# EAGLE board RefOsc10MHz_3V0_bga-escaped (EAGLE 7.2.0)
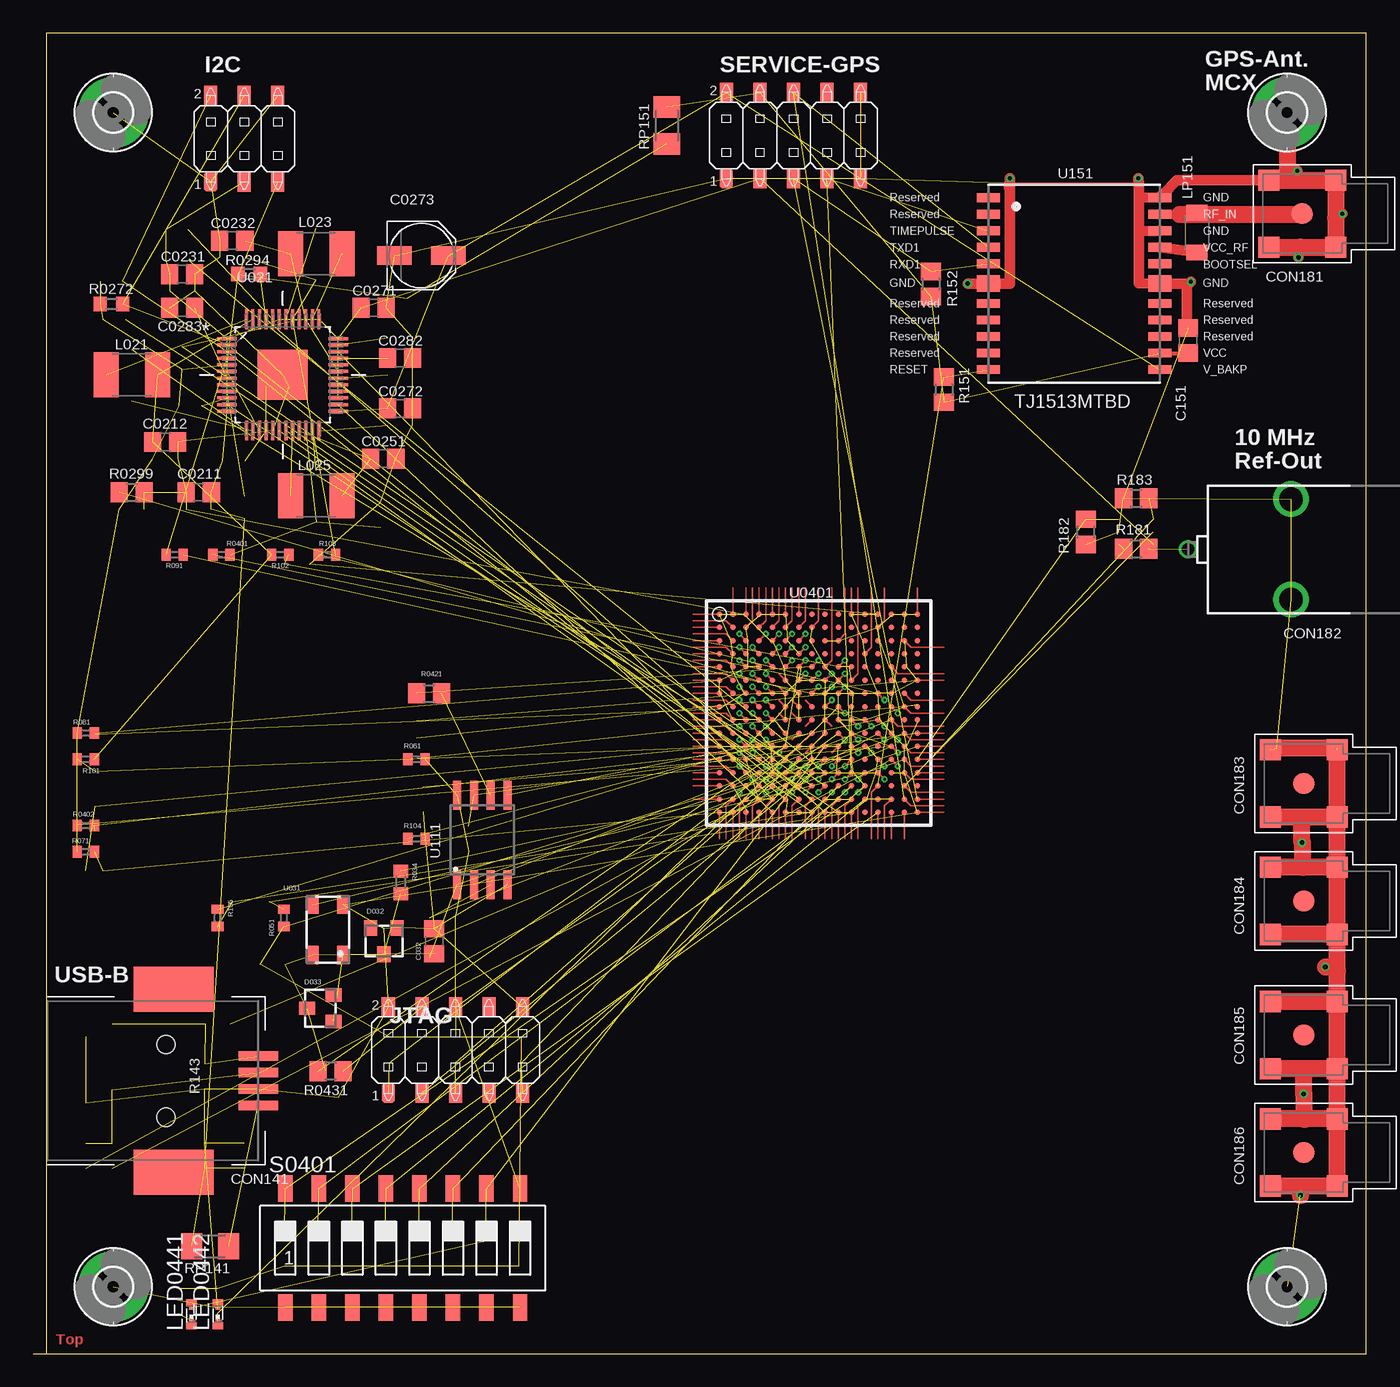
[diagram p27: board, top side]
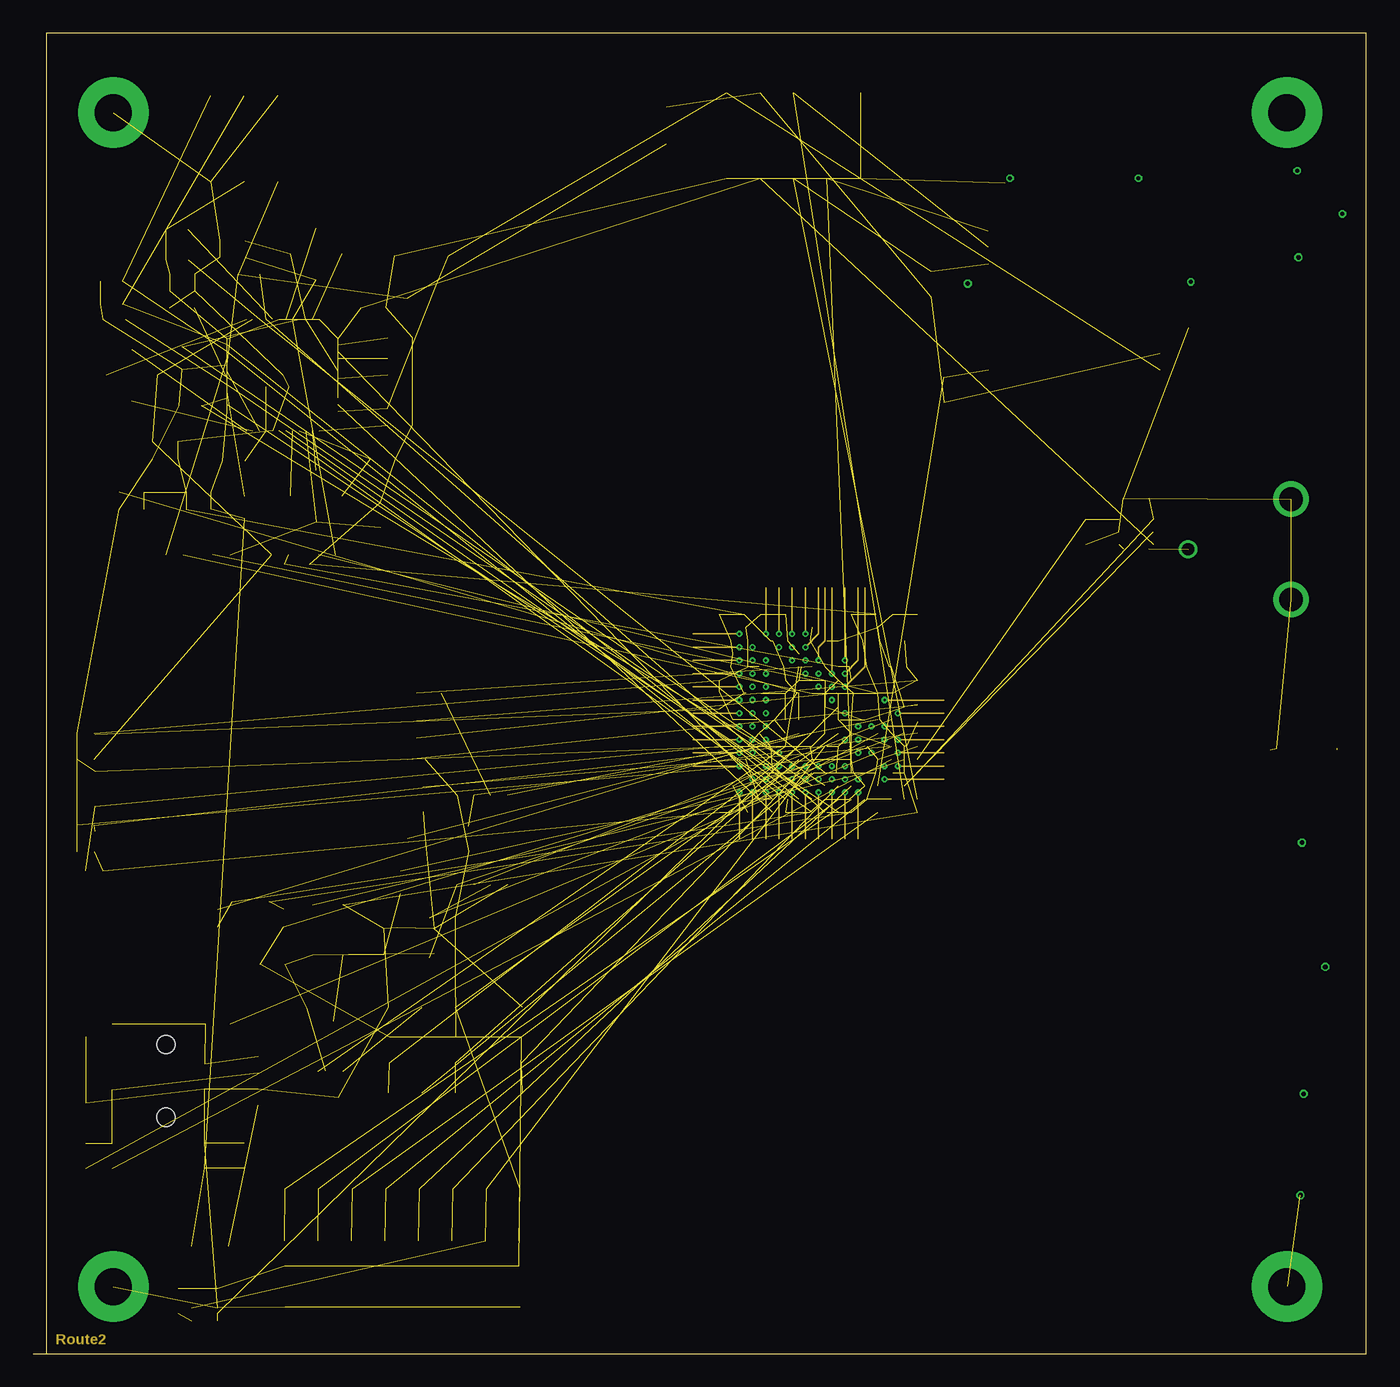
[diagram p28: board, inner layer Route2]
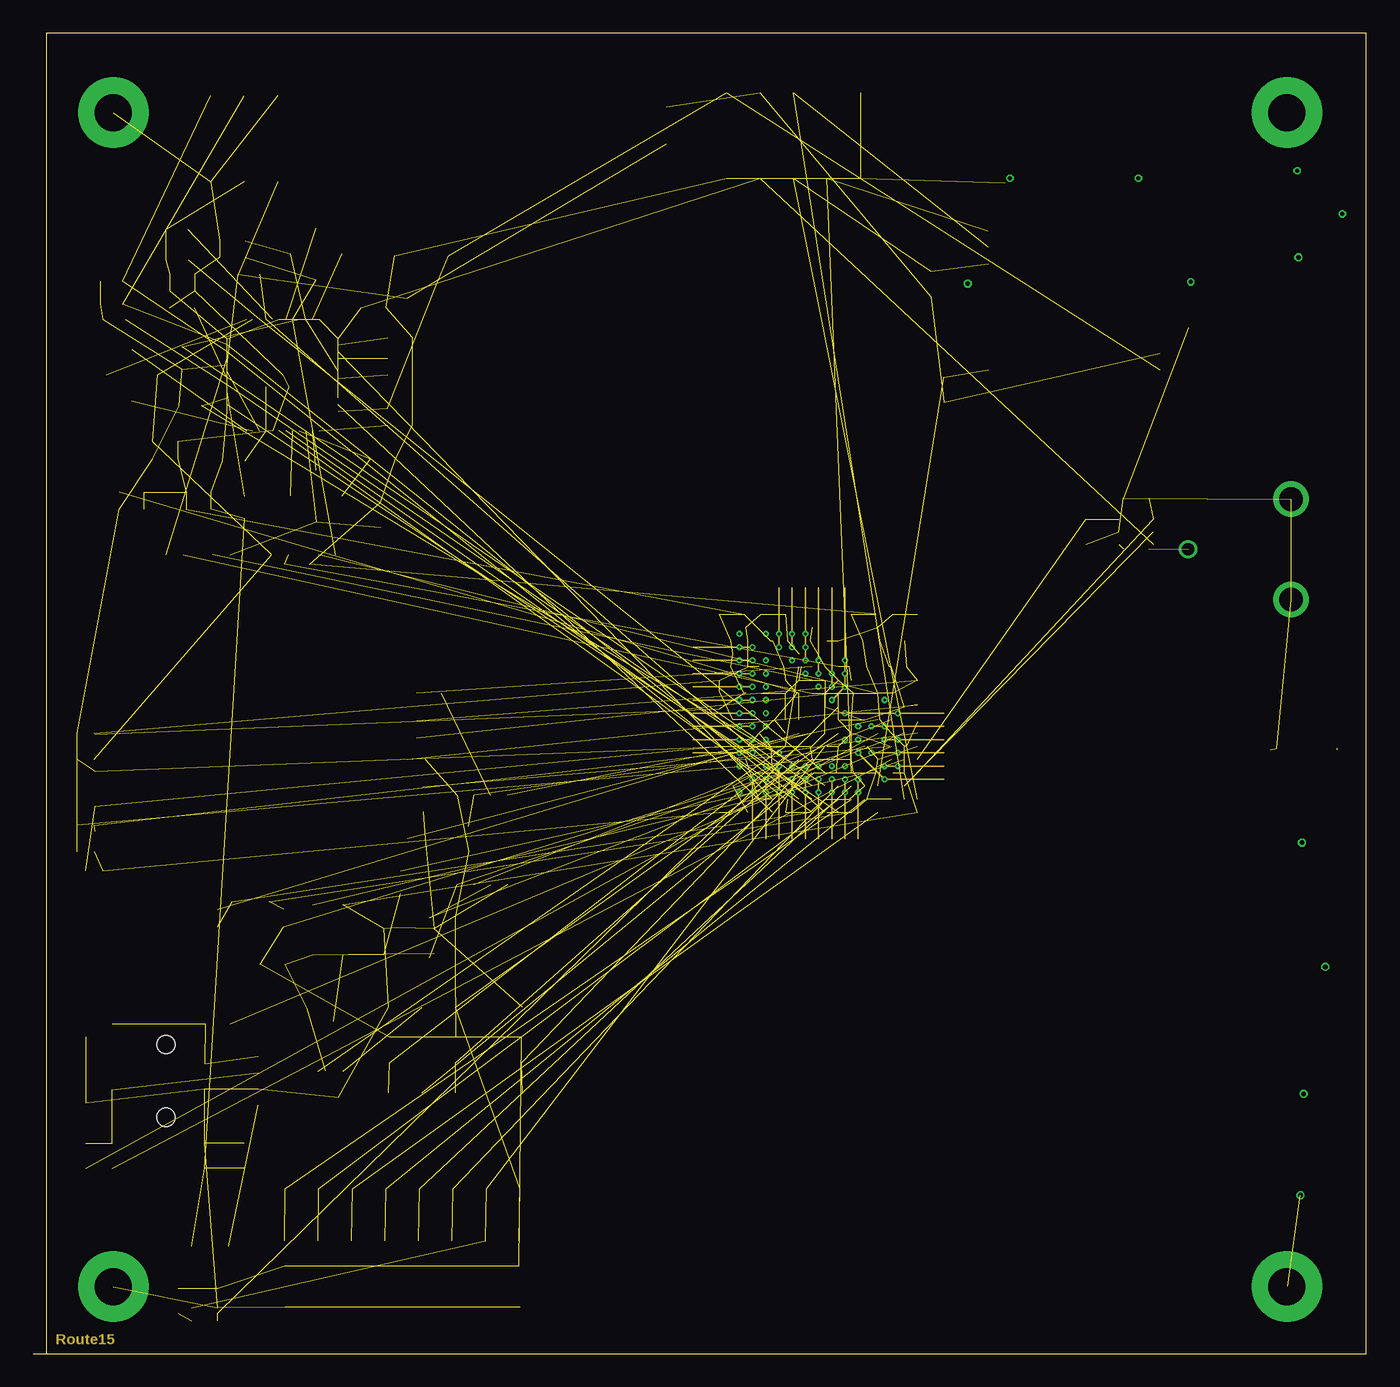
[diagram p29: board, inner layer Route15]
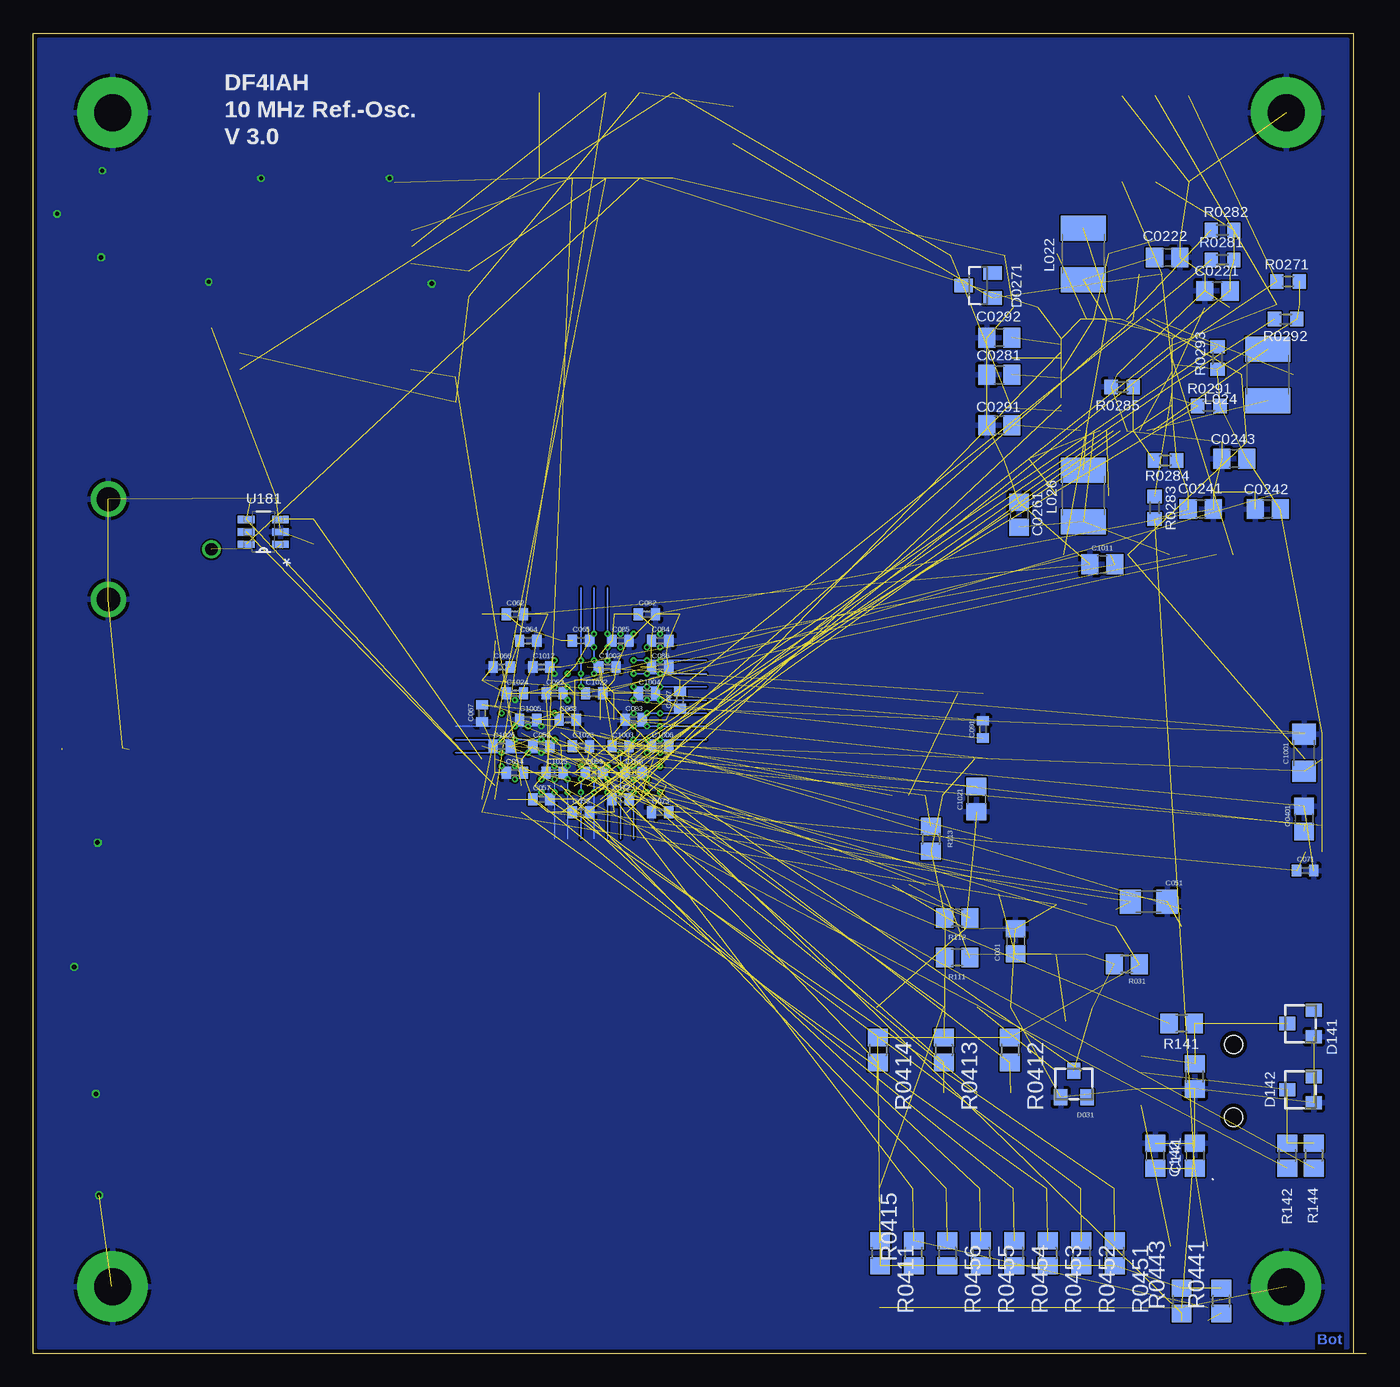
[diagram p30: board, bottom side, seen from below]

Size 101 x 100 mm. Coordinates in mm from the lower left corner, seen from the top.
Outline: 1,0 101,0 101,100 1,100 1,0
Outline: 0,0 1,0
Copper layers (1+2+15+16): Top 0.035mm / dielectric 0.38mm / Route2 0.035mm / dielectric 0.71mm / Route15 0.035mm / dielectric 0.38mm / Bottom 0.035mm
Design rules "PCB-Pool_HighQuality_4Layers": minimum track width 5mil, minimum drill 8mil, track to track 5mil, track to pad 5mil, pad to pad 5mil, via to via 5mil, smd to smd 0mil, copper to edge 12mil, drill to drill 12mil, minimum pad ring 8mil, minimum via ring 5mil, stop-mask expansion 2mil, vias tented up to drill 25mil, thermal gap 10mil
Net classes: 1 PWR_LOW: width 0.254 mm; 2 PWR_MED: width 0.305 mm; 3 PWR_HI: width 0.381 mm; 4 PAIR_50R: width 1.27 mm, clearance 1.27 mm; 5 PAIR_100R: width 0.635 mm, clearance 0.635 mm; 6 CLK: clearance 0.635 mm
tRestrict: area 95,80 to 97.5,80

## Footprints (pad centres in the part's own frame; a part is rotated, then mirrored left to right if it is on the bottom)
C0805 = smd 1.3 x 1.5: 1 -0.95,0; 2 0.95,0
C1206 = smd 1.6 x 1.8: 1 -1.4,0; 2 1.4,0
C0402 = smd 0.7 x 0.9: 1 -0.65,0; 2 0.65,0
PANASONIC_C = smd 2.6 x 1.4: + 2.05,0; - -2.05,0
2X03SMD = smd 1 x 1.5: 1 -2.54,-3.25; 2 -2.54,3.25; 3 0,-3.25; 4 0,3.25; 5 2.54,-3.25; 6 2.54,3.25
TYCO-AMP_USB-B_SMT = smd 6.04 x 3.4: 0A 0,6.92; 0B 0,-6.92 | smd 3 x 0.7: 1 -6.42,1.87; 2 -6.42,-0.62; 3 -6.42,-1.87; 4 -6.42,0.62 | hole 1.4: 0.58,-2.75; 0.58,2.75
2X5SMD = smd 1 x 1.5: 1 -5.08,-3.25; 2 -5.08,3.25; 3 -2.54,-3.25; 4 -2.54,3.25; 5 0,-3.25; 6 0,3.25; 7 2.54,-3.25; 8 2.54,3.25; 9 5.08,-3.25; 10 5.08,3.25
MCX-J-P-X-RA-SM1 = smd 1.6 x 1.6: 1 0,0; 2 -2.54,2.54; 3 2.54,2.54; 4 -2.54,-2.54; 5 2.54,-2.54
MOLEX_BNC-JACK-50R_SD-73100-0105 = drill 0.92: 1 12.4,0 | drill 1.8: 2 4.6,3.8; 3 4.6,-3.8
TO236 = smd 1 x 1.2: A -1,-1; C 0,1; NC 1,-1
SOT23 = smd 1 x 1.4: 1 -0.95,-1.1; 2 0.95,-1.1; 3 0,1.1
2,8-PAD = drill 2.8 pad 5.334: B2,8 0,0
L1812 = smd 1.9 x 3.4: 1 -1.95,0; 2 1.95,0
SMARTLED-TTW = smd 0.8 x 0.5: A 0,-0.875; C 0,0.875 | smd 0.35 x 0.35: A@1 0,-0.5; C@1 0,0.5
L3216C = smd 1.2 x 1.6: 1 -1.5,0; 2 1.5,0
R0805 = smd 1.3 x 1.5: 1 -0.95,0; 2 0.95,0
R0603 = smd 1 x 1.1: 1 -0.85,0; 2 0.85,0
R0402 = smd 0.7 x 0.9: 1 -0.65,0; 2 0.65,0
M1206 = smd 1.6 x 2: 1 -1.4,0; 2 1.4,0
SMS-008 = smd 1.092 x 2.007: 1 -8.89,-4.496; 2 -6.35,-4.496; 3 -3.81,-4.496; 4 -1.27,-4.496; 5 1.27,-4.496; 6 3.81,-4.496; 7 6.35,-4.496; 8 8.89,-4.496; 9 8.89,4.496; 10 6.35,4.496; 11 3.81,4.496; 12 1.27,4.496; 13 -1.27,4.496; 14 -3.81,4.496; 15 -6.35,4.496; 16 -8.89,4.496
QFP50P900X900X120-49N2 = smd 1.5 x 0.225: 1 -4.216,2.743; 2 -4.216,2.261; 3 -4.216,1.753; 4 -4.216,1.245; 5 -4.216,0.762; 6 -4.216,0.254; 7 -4.216,-0.254; 8 -4.216,-0.762; 9 -4.216,-1.245; 10 -4.216,-1.753; 11 -4.216,-2.261; 12 -4.216,-2.743; 25 4.216,-2.743; 26 4.216,-2.261; 27 4.216,-1.753; 28 4.216,-1.245; 29 4.216,-0.762; 30 4.216,-0.254; 31 4.216,0.254; 32 4.216,0.762; 33 4.216,1.245; 34 4.216,1.753; 35 4.216,2.261; 36 4.216,2.743 | smd 0.225 x 1.5: 13 -2.743,-4.216; 14 -2.261,-4.216; 15 -1.753,-4.216; 16 -1.245,-4.216; 17 -0.762,-4.216; 18 -0.254,-4.216; 19 0.254,-4.216; 20 0.762,-4.216; 21 1.245,-4.216; 22 1.753,-4.216; 23 2.261,-4.216; 24 2.743,-4.216; 37 2.743,4.216; 38 2.261,4.216; 39 1.753,4.216; 40 1.245,4.216; 41 0.762,4.216; 42 0.254,4.216; 43 -0.254,4.216; 44 -0.762,4.216; 45 -1.245,4.216; 46 -1.753,4.216; 47 -2.261,4.216; 48 -2.743,4.216 | smd 3.8 x 3.8: 49 0,0
CFPT-141 = smd 1.4 x 0.9: 1 -1.9,-1.15; 2 1.9,-1.15; 3 1.9,1.15; 4 -1.9,1.15
SOP2-8 = smd 2.2 x 0.6: 1 -3.5,1.874; 2 -3.5,0.604; 3 -3.5,-0.666; 4 -3.5,-1.936; 5 3.3,-1.936; 6 3.3,-0.666; 7 3.3,0.604; 8 3.3,1.874
TJ1513MTBD = smd 1.75 x 0.667: 1 -6.35,6.62; 2 -6.35,5.37; 3 -6.35,4.12; 4 -6.35,2.87; 5 -6.35,1.62; 7 -6.35,-1.38; 8 -6.35,-2.63; 9 -6.35,-3.88; 10 -6.35,-5.13; 11 -6.35,-6.38; 12 6.65,-6.38; 13 6.65,-5.13; 14 6.65,-3.88; 15 6.65,-2.63; 16 6.65,-1.38; 18 6.65,1.62; 19 6.65,2.87; 20 6.65,4.12; 21 6.65,5.37; 22 6.65,6.62 | smd 1.75 x 1.25: 6 -6.35,0.12; 17 6.65,0.12
SOT-23-6 = smd 1.27 x 0.559: 1 -1.295,0.94; 2 -1.295,0; 3 -1.295,-0.94; 4 1.295,-0.94; 5 1.295,0; 6 1.295,0.94
FTG256_0MM4 = smd 0.4 x 0.4: A1 -7.5,7.5; A2 -6.5,7.5; A3 -5.5,7.5; A4 -4.5,7.5; A5 -3.5,7.5; A6 -2.5,7.5; A7 -1.5,7.5; A8 -0.5,7.5; A9 0.5,7.5; A10 1.5,7.5; A11 2.5,7.5; A12 3.5,7.5; A13 4.5,7.5; A14 5.5,7.5; A15 6.5,7.5; A16 7.5,7.5; B1 -7.5,6.5; B2 -6.5,6.5; B3 -5.5,6.5; B4 -4.5,6.5; B5 -3.5,6.5; B6 -2.5,6.5; B7 -1.5,6.5; B8 -0.5,6.5; B9 0.5,6.5; B10 1.5,6.5; B11 2.5,6.5; B12 3.5,6.5; B13 4.5,6.5; B14 5.5,6.5; B15 6.5,6.5; B16 7.5,6.5; C1 -7.5,5.5; C2 -6.5,5.5; C3 -5.5,5.5; C4 -4.5,5.5; C5 -3.5,5.5; C6 -2.5,5.5; C7 -1.5,5.5; C8 -0.5,5.5; C9 0.5,5.5; C10 1.5,5.5; C11 2.5,5.5; C12 3.5,5.5; C13 4.5,5.5; C14 5.5,5.5; C15 6.5,5.5; C16 7.5,5.5; D1 -7.5,4.5; D2 -6.5,4.5; D3 -5.5,4.5; D4 -4.5,4.5; D5 -3.5,4.5; D6 -2.5,4.5; D7 -1.5,4.5; D8 -0.5,4.5; D9 0.5,4.5; D10 1.5,4.5; D11 2.5,4.5; D12 3.5,4.5; D13 4.5,4.5; D14 5.5,4.5; D15 6.5,4.5; D16 7.5,4.5; E1 -7.5,3.5; E2 -6.5,3.5; E3 -5.5,3.5; E4 -4.5,3.5; E5 -3.5,3.5; E6 -2.5,3.5; E7 -1.5,3.5; E8 -0.5,3.5; E9 0.5,3.5; E10 1.5,3.5; E11 2.5,3.5; E12 3.5,3.5; E13 4.5,3.5; E14 5.5,3.5; E15 6.5,3.5; E16 7.5,3.5; F1 -7.5,2.5; F2 -6.5,2.5; F3 -5.5,2.5; F4 -4.5,2.5; F5 -3.5,2.5; F6 -2.5,2.5; F7 -1.5,2.5; F8 -0.5,2.5; F9 0.5,2.5; F10 1.5,2.5; F11 2.5,2.5; F12 3.5,2.5; F13 4.5,2.5; F14 5.5,2.5; F15 6.5,2.5; F16 7.5,2.5; G1 -7.5,1.5; G2 -6.5,1.5; G3 -5.5,1.5; G4 -4.5,1.5; G5 -3.5,1.5; G6 -2.5,1.5; G7 -1.5,1.5; G8 -0.5,1.5; G9 0.5,1.5; G10 1.5,1.5; G11 2.5,1.5; G12 3.5,1.5; G13 4.5,1.5; G14 5.5,1.5; G15 6.5,1.5; G16 7.5,1.5; H1 -7.5,0.5; H2 -6.5,0.5; H3 -5.5,0.5; H4 -4.5,0.5; H5 -3.5,0.5; H6 -2.5,0.5; H7 -1.5,0.5; H8 -0.5,0.5; H9 0.5,0.5; H10 1.5,0.5; H11 2.5,0.5; H12 3.5,0.5; H13 4.5,0.5; H14 5.5,0.5; H15 6.5,0.5; H16 7.5,0.5; J1 -7.5,-0.5; J2 -6.5,-0.5; J3 -5.5,-0.5; J4 -4.5,-0.5; J5 -3.5,-0.5; J6 -2.5,-0.5; J7 -1.5,-0.5; J8 -0.5,-0.5; J9 0.5,-0.5; J10 1.5,-0.5; J11 2.5,-0.5; J12 3.5,-0.5; J13 4.5,-0.5; J14 5.5,-0.5; J15 6.5,-0.5; J16 7.5,-0.5; K1 -7.5,-1.5; K2 -6.5,-1.5; K3 -5.5,-1.5; K4 -4.5,-1.5; K5 -3.5,-1.5; K6 -2.5,-1.5; K7 -1.5,-1.5; K8 -0.5,-1.5; K9 0.5,-1.5; K10 1.5,-1.5; K11 2.5,-1.5; K12 3.5,-1.5; K13 4.5,-1.5; K14 5.5,-1.5; K15 6.5,-1.5; K16 7.5,-1.5; L1 -7.5,-2.5; L2 -6.5,-2.5; L3 -5.5,-2.5; L4 -4.5,-2.5; L5 -3.5,-2.5; L6 -2.5,-2.5; L7 -1.5,-2.5; L8 -0.5,-2.5; L9 0.5,-2.5; L10 1.5,-2.5; L11 2.5,-2.5; L12 3.5,-2.5; L13 4.5,-2.5; L14 5.5,-2.5; L15 6.5,-2.5; L16 7.5,-2.5; M1 -7.5,-3.5; M2 -6.5,-3.5; M3 -5.5,-3.5; M4 -4.5,-3.5; M5 -3.5,-3.5; M6 -2.5,-3.5; M7 -1.5,-3.5; M8 -0.5,-3.5; M9 0.5,-3.5; M10 1.5,-3.5; M11 2.5,-3.5; M12 3.5,-3.5; M13 4.5,-3.5; M14 5.5,-3.5; M15 6.5,-3.5; M16 7.5,-3.5; N1 -7.5,-4.5; N2 -6.5,-4.5; N3 -5.5,-4.5; N4 -4.5,-4.5; N5 -3.5,-4.5; N6 -2.5,-4.5; N7 -1.5,-4.5; N8 -0.5,-4.5; N9 0.5,-4.5; N10 1.5,-4.5; N11 2.5,-4.5; N12 3.5,-4.5; N13 4.5,-4.5; N14 5.5,-4.5; N15 6.5,-4.5; N16 7.5,-4.5; P1 -7.5,-5.5; P2 -6.5,-5.5; P3 -5.5,-5.5; P4 -4.5,-5.5; P5 -3.5,-5.5; P6 -2.5,-5.5; P7 -1.5,-5.5; P8 -0.5,-5.5; P9 0.5,-5.5; P10 1.5,-5.5; P11 2.5,-5.5; P12 3.5,-5.5; P13 4.5,-5.5; P14 5.5,-5.5; P15 6.5,-5.5; P16 7.5,-5.5; R1 -7.5,-6.5; R2 -6.5,-6.5; R3 -5.5,-6.5; R4 -4.5,-6.5; R5 -3.5,-6.5; R6 -2.5,-6.5; R7 -1.5,-6.5; R8 -0.5,-6.5; R9 0.5,-6.5; R10 1.5,-6.5; R11 2.5,-6.5; R12 3.5,-6.5; R13 4.5,-6.5; R14 5.5,-6.5; R15 6.5,-6.5; R16 7.5,-6.5; T1 -7.5,-7.5; T2 -6.5,-7.5; T3 -5.5,-7.5; T4 -4.5,-7.5; T5 -3.5,-7.5; T6 -2.5,-7.5; T7 -1.5,-7.5; T8 -0.5,-7.5; T9 0.5,-7.5; T10 1.5,-7.5; T11 2.5,-7.5; T12 3.5,-7.5; T13 4.5,-7.5; T14 5.5,-7.5; T15 6.5,-7.5; T16 7.5,-7.5

## Placement (x,y rotation side)
C031  100n  [C0805]  26.58,31.24 90 bottom
C032  10uF  [C0805]  30.39,31.24 90 top
C051  100uF  [C1206]  16.5,34.23 0 bottom
C052  4.7uF  [C0402]  62.5,46 0 bottom
C053  4.7uF  [C0402]  59.5,41 0 bottom
C054  0.47uF  [C0402]  64.5,44 180 bottom
C055  0.47uF  [C0402]  58.5,44 0 bottom
C056  0.47uF  [C0402]  55.5,44 0 bottom
C057  0.47uF  [C0402]  62.5,42 0 bottom
C062  4.7uF  [C0402]  64.5,56 0 bottom
C063  4.7uF  [C0402]  60.5,48 0 bottom
C064  0.47uF  [C0402]  63.5,54 0 bottom
C065  0.47uF  [C0402]  59.5,54 0 bottom
C066  0.47uF  [C0402]  65.5,52 180 bottom
C067  0.47uF  [C0402]  67,48.5 270 bottom
C071  4.7uF  [C0402]  4.64,36.59 0 bottom
C072  0.47uF  [C0402]  56.5,42 180 bottom
C073  0.47uF  [C0402]  53.5,41 180 bottom
C082  4.7uF  [C0402]  54.5,56 0 bottom
C083  4.7uF  [C0402]  55.5,48 180 bottom
C084  0.47uF  [C0402]  53.5,54 0 bottom
C085  0.47uF  [C0402]  56.5,54 0 bottom
C086  0.47uF  [C0402]  53.5,52 0 bottom
C087  0.47uF  [C0402]  52,49.5 270 bottom
C091  4.7uF  [C0402]  29.04,47.27 90 bottom
C092  0.47uF  [C0402]  61.5,50 180 bottom
C141  47uF  [C0805]  16,15 90 bottom
C142  100n  [C0805]  13,15 90 bottom
C151  100n  [C0805]  87.49,76.72 90 top
C0211  4.7uF  [C0805]  12.56,65.23 180 top
C0212  22uF  [C0805]  10.02,69.04 0 top
C0221  4.7uF  [C0805]  11.29,80.47 180 bottom
C0222  22uF  [C0805]  15.1,83.01 0 bottom
C0231  4.7uF  [C0805]  11.29,81.74 0 top
C0232  22uF  [C0805]  15.1,84.28 180 top
C0241  4.7uF  [C0805]  12.56,63.96 0 bottom
C0242  100uF  [C0805]  7.48,63.96 180 bottom
C0243  100nF  [C0805]  10.02,67.77 180 bottom
C0251  22uF  [C0805]  26.53,67.77 0 top
C0261  22uF  [C0805]  26.31,63.53 90 bottom
C0271  4.7uF  [C0805]  25.8,79.2 0 top
C0272  4.7uF  [C0805]  27.8,71.58 0 top
C0273  0.22F  [PANASONIC_C]  29.42,83.15 0 top
C0281  22uF  [C0805]  27.8,74.12 180 bottom
C0282  22uF  [C0805]  27.8,75.39 0 top
C0283  22uF  [C0805]  11.29,79.2 180 top
C0291  1uF  [C0805]  27.8,70.31 180 bottom
C0292  100nF  [C0805]  27.8,76.93 180 bottom
C0401  47uF  [C0805]  4.73,40.5 90 bottom
C1001  100uF  [C1206]  4.73,45.5 90 bottom
C1002  4.7uF  [C0402]  57.5,52 0 bottom
C1003  4.7uF  [C0402]  56.5,46 0 bottom
C1004  0.47uF  [C0402]  54.5,50 0 bottom
C1005  0.47uF  [C0402]  63.5,48 180 bottom
C1006  0.47uF  [C0402]  53.5,46 180 bottom
C1011  47uF  [C0805]  20,59.77 180 bottom
C1012  0.47uF  [C0402]  62.5,52 180 bottom
C1021  47uF  [C0805]  29.54,42 270 bottom
C1022  4.7uF  [C0402]  58.5,50 0 bottom
C1023  4.7uF  [C0402]  59.5,46 0 bottom
C1024  0.47uF  [C0402]  64.5,50 180 bottom
C1025  0.47uF  [C0402]  61.5,44 180 bottom
C1026  0.47uF  [C0402]  65.5,46 180 bottom
CON051  HEADER-2X3SMD  [2X03SMD]  16,92 0 top
CON141  TYCO-AMP_USBUSB-B_SMT  [TYCO-AMP_USB-B_SMT]  10.65,20.67 180 top
CON151  HEADER-2X5SMD  [2X5SMD]  57.6,92.24 0 top
CON181  MCX-J-P-X-RA-SM1  [MCX-J-P-X-RA-SM1]  96.13,86.32 270 top
CON182  SD-73100-0105  [MOLEX_BNC-JACK-50R_SD-73100-0105]  99.89,60.91 180 top
CON183  MCX-J-P-X-RA-SM1  [MCX-J-P-X-RA-SM1]  96.25,43.18 270 top
CON184  MCX-J-P-X-RA-SM1  [MCX-J-P-X-RA-SM1]  96.25,34.29 270 top
CON185  MCX-J-P-X-RA-SM1  [MCX-J-P-X-RA-SM1]  96.25,24.13 270 top
CON186  MCX-J-P-X-RA-SM1  [MCX-J-P-X-RA-SM1]  96.25,15.24 270 top
CON0401  AVR-JTAG-10SMD  [2X5SMD]  32,23 0 top
D031  BZX84-C3V0  [TO236]  22.16,20.42 0 bottom
D032  BZX84-C3V6  [TO236]  26.58,31.24 180 top
D033  BZX84-C3V6  [TO236]  21.77,26.16 90 top
D141  BZX84-C3V6  [TO236]  5,25 90 bottom
D142  BZX84-C3V6  [TO236]  5,20 90 bottom
D0271  CRS08  [SOT23]  29.42,80.88 90 bottom
H191  MOUNT-PAD-ROUND2.8  [2,8-PAD]  6.08,5.08 0 top
H192  MOUNT-PAD-ROUND2.8  [2,8-PAD]  94.98,5.08 0 top
H193  MOUNT-PAD-ROUND2.8  [2,8-PAD]  94.98,93.98 0 top
H194  MOUNT-PAD-ROUND2.8  [2,8-PAD]  6.08,93.98 0 top
L021  1.5uH  [L1812]  7.48,74.12 180 top
L022  1.5uH  [L1812]  21.45,83.28 90 bottom
L023  1.5uH  [L1812]  21.45,83.28 180 top
L024  1.5uH  [L1812]  7.48,74.12 270 bottom
L025  10uH  [L1812]  21.45,64.96 180 top
L026  10uH  [L1812]  21.45,64.96 90 bottom
LED0441  [SMARTLED-TTW]  12,3 0 top
LED0442  [SMARTLED-TTW]  14,3 0 top
LP151  WE-CBF_300R  [L3216C]  88.16,84.89 270 top
R031  56  [R0805]  18.16,29.5 180 bottom
R034  15k  [R0603]  27.86,35.69 90 top
R051  0  [R0402]  19,33 270 top
R061  0  [R0402]  29.04,45 0 top
R071  0  [R0402]  4,38 180 top
R081  0  [R0402]  4,47 180 top
R091  0  [R0402]  10.73,60.5 180 top
R101  0  [R0402]  4,45 0 top
R102  0  [R0402]  18.73,60.5 180 top
R103  0  [R0402]  22.27,60.5 0 top
R104  0  [R0402]  29.04,39 0 top
R105  0  [R0402]  14,33 270 top
R111  4.7k  [R0805]  31,30 180 bottom
R112  100k  [R0805]  31,33 180 bottom
R113  100k  [R0805]  33,39 270 bottom
R141  68  [R0805]  14,25 180 bottom
R142  68  [R0805]  6,15 270 bottom
R143  1M  [R0805]  13,21 90 bottom
R144  1.5k  [R0805]  4,15 270 bottom
R151  100k  [R0805]  69,73 270 top
R152  100k  [R0805]  68,81 270 top
R181  51  [R0805]  83.55,60.96 0 top
R182  120  [R0805]  79.74,62.23 90 top
R183  120  [R0805]  83.55,64.77 0 top
R0271  1.5k  [R0603]  5.94,81.2 180 bottom
R0272  1.5k  [R0603]  5.94,79.47 0 top
R0281  100k  [R0603]  10.91,82.83 0 bottom
R0282  100k  [R0603]  10.91,85.1 0 bottom
R0283  100k  [R0603]  16.04,64.06 270 bottom
R0284  47k  [R0603]  15.23,67.63 0 bottom
R0285  10k  [R0603]  18.5,73.2 180 bottom
R0291  100k  [R0603]  11.94,71.77 0 bottom
R0292  100k  [R0603]  6.12,78.33 0 bottom
R0293  100k  [R0603]  11.29,75.39 270 bottom
R0294  100k  [R0603]  16.37,81.74 180 top
R0299  0  [R0805]  7.48,65.23 0 top
R0401  0  [R0402]  14.27,60.5 0 top
R0402  0  [R0402]  4,40 180 top
R0411  4.7k  [R0805]  36.83,7.62 270 bottom
R0412  4.7k  [R0805]  27,23 270 bottom
R0413  4.7k  [R0805]  32,23 270 bottom
R0414  4.7k  [R0805]  37,23 270 bottom
R0415  4.7k  [R0805]  34.29,7.62 90 bottom
R0421  22  [R0805]  30,50 0 top
R0431  150  [R0805]  22.54,21.39 180 top
R0441  470  [R0805]  11,4 90 bottom
R0443  470  [R0805]  14,4 90 bottom
R0451  4.7k  [R0805]  19.05,7.62 270 bottom
R0452  4.7k  [R0805]  21.59,7.62 270 bottom
R0453  4.7k  [R0805]  24.13,7.62 270 bottom
R0454  4.7k  [R0805]  26.67,7.62 270 bottom
R0455  4.7k  [R0805]  29.21,7.62 270 bottom
R0456  4.7k  [R0805]  31.75,7.62 270 bottom
RP141  1206L025YR_0.5A  [M1206]  13.41,8.14 180 top
RP151  1206L012WR_0.1A  [M1206]  48,93 90 top
S0401  SWS008  [SMS-008]  28,8 0 top
U021  [QFP50P900X900X120-49N2]  18.91,74.12 0 top
U031  CFPT-141  [CFPT-141]  22.34,32.11 90 top
U111  [SOP2-8]  34,39 90 top
U151  TJ1513MTBD  [TJ1513MTBD]  78.7,80.9 0 top
U181  OPA357  [SOT-23-6]  83.55,62.23 180 bottom
U0401  XC7A35TFTG256  [FTG256_0MM4]  59.5,48.5 0 top

## Tracks (layer width: path | path; a pad name or v marks a point on that pad's centre or on a via)
AD4N
  Top 0.127: U0401.A7 58,58
AD4P
  Top 0.127: U0401.B7 58.5,55.5 58.5,58
AD5N
  Top 0.127: U0401.A4 55,58
AD5P
  Top 0.127: U0401.A5 56,58
AD12N
  Top 0.127: U0401.B5 56.5,55.5 56.5,58
AD12P
  Top 0.127: U0401.B6 57.5,55.5 57.5,58
AGND  (3 unrouted)
  Top 0.127: U0401.G7 57.5,50.5 | U0401.H7 57.5,49.5 | U0401.J7 57.5,48.5
DAC1B0
  Top 0.127: U0401.A3 54,58
DAC1B1  (via drill 0.2)
  Top 0.127: U0401.C7 v58.5,54.5
  Route2 0.127: v58.5,54.5 58.5,58
DAC1B2  (via drill 0.2)
  Top 0.127: U0401.C6 v57.5,54.5
  Route2 0.127: v57.5,54.5 57.5,58
DAC1B3  (via drill 0.2)
  Top 0.127: U0401.D6 v57.5,53.5
  Route15 0.127: v57.5,53.5 57.5,58
DAC1B4  (via drill 0.2)
  Top 0.127: U0401.D5 v56.5,53.5
  Route15 0.127: v56.5,53.5 56.5,58
DAC1B5  (via drill 0.2)
  Top 0.127: U0401.C3 v53.5,54.5
  Route2 0.127: v53.5,54.5 50,54.5
DAC1B6
  Top 0.127: U0401.C2 52.5,54.5 50,54.5
DAC1B7
  Top 0.127: U0401.B2 52.5,55.5 50,55.5
DAC1B8
  Top 0.127: U0401.A2 53,58
DAC1B9
  Top 0.127: U0401.C1 50,54
DAC1C
  Top 0.127: U0401.B4 55.5,55.5 55.5,58
DAC1G0  (via drill 0.2)
  Top 0.127: U0401.P3 v53.5,42.5
  Route2 0.127: v53.5,42.5 53.5,39
DAC1G1  (via drill 0.2)
  Top 0.127: U0401.M5 v55.5,44.5
  Bottom 0.127: v55.5,44.5 55.5,39
DAC1G2  (via drill 0.2)
  Top 0.127: U0401.N4 v54.5,43.5
  Route15 0.127: v54.5,43.5 54.5,39
DAC1G3
  Top 0.127: U0401.R2 52.5,41.5 52.5,39
DAC1G4
  Top 0.127: U0401.R1 50,42
DAC1G5
  Top 0.127: U0401.R3 53.5,41.5 53.5,39
DAC1G6
  Top 0.127: U0401.T2 53,39
DAC1G7
  Top 0.127: U0401.T4 55,39
DAC1G8
  Top 0.127: U0401.T3 54,39
DAC1G9  (via drill 0.2)
  Top 0.127: U0401.P5 v55.5,42.5
  Route2 0.127: v55.5,42.5 55.5,39
DAC1NPS  (via drill 0.2)
  Top 0.127: U0401.E6 v57.5,52.5
  Bottom 0.127: v57.5,52.5 57.5,58
DAC1R0  (via drill 0.2)
  Top 0.127: U0401.L5 v55.5,46.5
  Bottom 0.127: v55.5,46.5 50,46.5
DAC1R1  (via drill 0.2)
  Top 0.127: U0401.L4 v54.5,46.5
  Route15 0.127: v54.5,46.5 50,46.5
DAC1R2  (via drill 0.2)
  Top 0.127: U0401.M4 v54.5,45.5
  Route15 0.127: v54.5,45.5 50,45.5
DAC1R3
  Top 0.127: U0401.M2 52.5,45.5 50,45.5
DAC1R4
  Top 0.127: U0401.M1 50,45
DAC1R5  (via drill 0.2)
  Top 0.127: U0401.N3 v53.5,44.5
  Route2 0.127: v53.5,44.5 50,44.5
DAC1R6
  Top 0.127: U0401.N2 52.5,44.5 50,44.5
DAC1R7
  Top 0.127: U0401.N1 50,44
DAC1R8
  Top 0.127: U0401.P1 50,43
DAC1R9  (via drill 0.2)
  Top 0.127: U0401.P4 v54.5,42.5
  Route2 0.127: v54.5,42.5 54.5,39
DAC2B0
  Top 0.127: U0401.H1 50,49
DAC2B1  (via drill 0.2)
  Top 0.127: U0401.J3 v53.5,48.5
  Route2 0.127: v53.5,48.5 50,48.5
DAC2B2  (via drill 0.2)
  Top 0.127: U0401.H3 v53.5,49.5
  Route2 0.127: v53.5,49.5 50,49.5
DAC2B3
  Top 0.127: U0401.K1 50,47
DAC2B4
  Top 0.127: U0401.J1 50,48
DAC2B5  (via drill 0.2)
  Top 0.127: U0401.L3 v53.5,46.5
  Route2 0.127: v53.5,46.5 50,46.5
DAC2B6
  Top 0.127: U0401.L2 52.5,46.5 50,46.5
DAC2B7  (via drill 0.2)
  Top 0.127: U0401.K3 v53.5,47.5
  Route2 0.127: v53.5,47.5 50,47.5
DAC2B8
  Top 0.127: U0401.K2 52.5,47.5 50,47.5
DAC2B9  (via drill 0.2)
  Top 0.127: U0401.K5 v55.5,47.5
  Bottom 0.127: v55.5,47.5 50,47.5
DAC2C
  Top 0.127: U0401.E2 52.5,52.5 50,52.5
DAC2G0
  Top 0.127: U0401.E1 50,52
DAC2G1  (via drill 0.2)
  Top 0.127: U0401.G5 v55.5,50.5
  Bottom 0.127: v55.5,50.5 50,50.5
DAC2G2  (via drill 0.2)
  Top 0.127: U0401.G4 v54.5,50.5
  Route15 0.127: v54.5,50.5 50,50.5
DAC2G3
  Top 0.127: U0401.G2 52.5,50.5 50,50.5
DAC2G4
  Top 0.127: U0401.G1 50,50
DAC2G5  (via drill 0.2)
  Top 0.127: U0401.H5 v55.5,49.5
  Bottom 0.127: v55.5,49.5 50,49.5
DAC2G6  (via drill 0.2)
  Top 0.127: U0401.H4 v54.5,49.5
  Route15 0.127: v54.5,49.5 50,49.5
DAC2G7  (via drill 0.2)
  Top 0.127: U0401.J5 v55.5,48.5
  Bottom 0.127: v55.5,48.5 50,48.5
DAC2G8  (via drill 0.2)
  Top 0.127: U0401.J4 v54.5,48.5
  Route15 0.127: v54.5,48.5 50,48.5
DAC2G9
  Top 0.127: U0401.H2 52.5,49.5 50,49.5
DAC2NPS
  Top 0.127: U0401.B1 50,55
DAC2R0
  Top 0.127: U0401.D1 50,53
DAC2R1  (via drill 0.2)
  Top 0.127: U0401.E3 v53.5,52.5
  Route2 0.127: v53.5,52.5 50,52.5
DAC2R2  (via drill 0.2)
  Top 0.127: U0401.D3 v53.5,53.5
  Route2 0.127: v53.5,53.5 50,53.5
DAC2R3  (via drill 0.2)
  Top 0.127: U0401.D4 v54.5,53.5
  Route15 0.127: v54.5,53.5 50,53.5
DAC2R4  (via drill 0.2)
  Top 0.127: U0401.C4 v55.5,54.5
  Route2 0.127: v55.5,54.5 55.5,58
DAC2R5  (via drill 0.2)
  Top 0.127: U0401.F5 v55.5,51.5
  Bottom 0.127: v55.5,51.5 50,51.5
DAC2R6  (via drill 0.2)
  Top 0.127: U0401.E5 v55.5,52.5
  Bottom 0.127: v55.5,52.5 50,52.5
DAC2R7  (via drill 0.2)
  Top 0.127: U0401.F4 v54.5,51.5
  Route15 0.127: v54.5,51.5 50,51.5
DAC2R8  (via drill 0.2)
  Top 0.127: U0401.F3 v53.5,51.5
  Route2 0.127: v53.5,51.5 50,51.5
DAC2R9
  Top 0.127: U0401.F2 52.5,51.5 50,51.5
FPGA_ADC_VP_0
  Top 0.127: U0401.H8 58.5,49.5
FPGA_CCLK_INTERN  (via drill 0.2)  (1 unrouted)
  Top 0.127: U0401.E8 v59.5,52.5
  Route2 0.127: v59.5,52.5 59.5,53.5 60,54 60,58
FPGA_CFG_0  (via drill 0.2)  (2 unrouted)
  Top 0.127: U0401.P10 v60.5,42.5
  Route2 0.127: v60.5,42.5 60.5,39
FPGA_CFG_1  (via drill 0.2)  (2 unrouted)
  Top 0.127: U0401.P11 v61.5,42.5
  Route2 0.127: v61.5,42.5 61.5,39
FPGA_CFG_2  (2 unrouted)
  Top 0.127: U0401.R12 62.5,41.5 62.5,39
FPGA_CFG_3  (2 unrouted)
  Top 0.127: U0401.T13 64,39
FPGA_CFG_4  (2 unrouted)
  Top 0.127: U0401.R10 60.5,41.5 60.5,39
FPGA_CFG_5  (2 unrouted)
  Top 0.127: U0401.R11 61.5,41.5 61.5,39
FPGA_DXN_0  (1 unrouted)
  Top 0.127: U0401.K7 57.5,46.5
FPGA_DXP_0  (1 unrouted)
  Top 0.127: U0401.K8 58.5,46.5
FPGA_JTAG_TCK  (2 unrouted)
  Top 0.127: U0401.L7 57.5,45.5
FPGA_JTAG_TDI  (via drill 0.2)  (2 unrouted)
  Top 0.127: U0401.N7 v57.5,43.5
  Route15 0.127: v57.5,43.5 57.5,39
FPGA_JTAG_TDO  (via drill 0.2)  (1 unrouted)
  Top 0.127: U0401.N8 v58.5,43.5
  Route15 0.127: v58.5,43.5 58.5,39
FPGA_JTAG_TMS  (via drill 0.2)  (2 unrouted)
  Top 0.127: U0401.M7 v57.5,44.5
  Bottom 0.127: v57.5,44.5 57.5,39
FPGA_RS0
  Top 0.127: U0401.G15 66.5,49.5 69,49.5
FPGA_RS1  (via drill 0.2)
  Top 0.127: U0401.H14 v65.5,48.5
  Route2 0.127: v65.5,48.5 69,48.5
FPGA_SPI_CCLK  (1 unrouted)
FPGA_SPI_D00_MOSI  (via drill 0.2)  (1 unrouted)
  Top 0.127: U0401.J13 v64.5,47.5
  Route2 0.127: v64.5,47.5 69,47.5
FPGA_SPI_D01_DIN  (1 unrouted)
  Top 0.127: U0401.J14 65.5,47.5 69,47.5
FPGA_SPI_D02  (2 unrouted)
  Top 0.127: U0401.K15 66.5,46.5 69,46.5
FPGA_SPI_D03  (2 unrouted)
  Top 0.127: U0401.K16 69,47
FPGA_SPI_DONE  (via drill 0.2)  (2 unrouted)
  Top 0.127: U0401.H10 v61.5,48.5
  Route15 0.127: v61.5,48.5 69,48.5
FPGA_SPI_FCS_B#  (via drill 0.2)  (2 unrouted)
  Top 0.127: U0401.L12 v63.5,45.5
  Route15 0.127: v63.5,45.5 69,45.5
FPGA_SPI_INIT_B#  (via drill 0.2)  (3 unrouted)
  Top 0.127: U0401.K10 v61.5,46.5
  Bottom 0.127: v61.5,46.5 62.5,45.5 69,45.5
FPGA_SPI_PROGRAM_B#  (3 unrouted)
  Top 0.127: U0401.L9 59.5,45.5
FPGA_VCCADC_0  (via drill 0.2)  (3 unrouted)
  Top 0.127: U0401.G8 v59.5,50.5
  Bottom 0.127: v59.5,50.5 59.5,58
FPGA_VCCAUX  (via drill 0.2)  (10 unrouted)
  Top 0.127: U0401.L10 60.5,45.5 | U0401.K11 v62.5,46.5 | U0401.J10 61.5,47.5 | U0401.G10 v61.5,50.5
  Route2 0.127: v61.5,50.5 63,52 63,58
  Bottom 0.127: v62.5,46.5 69,46.5
FPGA_VCCBATT  (via drill 0.2)  (1 unrouted)
  Top 0.127: U0401.F8 v59.5,51.5
  Route15 0.127: v59.5,51.5 59.5,58
FPGA_VCCBRAM  (via drill 0.2)  (4 unrouted)
  Top 0.127: U0401.E10 v61.5,52.5 | U0401.F11 62.5,51.5 62.5,58
  Route2 0.127: v61.5,52.5 61.5,58
FPGA_VCCINT  (via drill 0.2)  (13 unrouted)
  Top 0.127: U0401.G6 56.5,50.5 | U0401.J6 56.5,48.5 | U0401.L8 58.5,45.5 | U0401.F9 v60.5,51.5 | U0401.F7 v58.5,51.5 | U0401.K9 59.5,46.5 | U0401.H9 v60.5,49.5
  Route2 0.127: v60.5,51.5 60.5,58
  Route15 0.127: v60.5,49.5 61.5,50.5 61.5,58
  Bottom 0.127: v58.5,51.5 58.5,58
FPGA_VCCO_0  (via drill 0.2)  (4 unrouted)
  Top 0.127: U0401.E7 v58.5,52.5 | U0401.L6 v56.5,45.5
  Route15 0.127: v58.5,52.5 58.5,58
  Bottom 0.127: v56.5,45.5 56.5,39
FPGA_VCCO_14  (via drill 0.2)  (13 unrouted)
  Top 0.127: U0401.T11 62,39 | U0401.L16 69,46 | U0401.R14 64.5,41.5 64.5,39 | U0401.P7 v57.5,42.5 | U0401.N10 v60.5,43.5 | U0401.M13 v64.5,44.5
  Route2 0.127: v57.5,42.5 57.5,39
  Route15 0.127: v60.5,43.5 60.5,39 | v64.5,44.5 69,44.5
FPGA_VCCO_15  (via drill 0.2)  (12 unrouted)
  Top 0.127: U0401.A16 67,58 | U0401.H15 66.5,48.5 69,48.5 | U0401.B13 64.5,55.5 64.5,58 | U0401.E14 65.5,51.5 69,51.5 | U0401.C10 61.5,54.5 61.5,58 | U0401.J12 v63.5,47.5
  Route15 0.127: v63.5,47.5 69,47.5
FPGA_VCCO_34  (via drill 0.2)  (6 unrouted)
  Top 0.127: U0401.T1 52,39 | U0401.R4 54.5,41.5 54.5,39 | U0401.M3 v53.5,45.5
  Route2 0.127: v53.5,45.5 50,45.5
FPGA_VCCO_35  (via drill 0.2)  (12 unrouted)
  Top 0.127: U0401.F1 50,51 | U0401.A6 57,58 | U0401.J2 52.5,48.5 50,48.5 | U0401.B3 54.5,55.5 54.5,58 | U0401.E4 v54.5,52.5 | U0401.D7 v58.5,53.5
  Route2 0.127: v58.5,53.5 59.5,54.5 59.5,58
  Route15 0.127: v54.5,52.5 50,52.5
GND  (via drill 0.2, 0.3, 0.35)  (136 unrouted)
  Top 0.127: U0401.A1 50,56 | U0401.L1 50,46 | U0401.T6 57,39 | U0401.T16 69,41 | U0401.F16 69,51 | U0401.A11 62,58 | U0401.D2 52.5,53.5 50,53.5 | U0401.P2 52.5,43.5 50,43.5 | U0401.R9 59.5,41.5 59.5,39 | U0401.N15 66.5,43.5 69,43.5 | U0401.L15 66.5,45.5 69,45.5 | U0401.C15 66.5,53.5 69,53.5 | U0401.B8 59.5,55.5 59.5,58 | U0401.G3 v53.5,50.5 | U0401.P12 v62.5,42.5 | U0401.K14 v65.5,46.5 | U0401.C5 v56.5,54.5 | U0401.K4 v54.5,47.5 | U0401.N5 v55.5,43.5 | U0401.G13 v64.5,49.5 | U0401.D12 63.5,53.5 63.5,58 | U0401.M8 v58.5,44.5 | U0401.M10 v60.5,44.5 | U0401.M11 v61.5,44.5 | U0401.E9 60.5,52.5 60.5,58 | U0401.F6 56.5,51.5 | U0401.H6 56.5,49.5 | U0401.K6 56.5,47.5 | U0401.L11 v62.5,45.5 | U0401.J11 v62.5,47.5 | U0401.F10 v61.5,51.5 | U0401.G9 v60.5,50.5 | U0401.J9 60.5,47.5
  Top 0.152: 73.6,88.65 74,88.59 | 93.1,21.75 CON185.5 | 73.6,88.35 74,88.35 | 95.05,5.1 H192.B2,8 | 73.6,88.2 74,88.2
  Top 0.203: 96.16,36.85 96.2,36.88 96.2,36.83 | 95.89,12.38 v96,12 | 85.6,87.81 85.53,87.88 U151.22 | 93.05,88.84 93.05,88.9 CON181.4 | 83.75,88.61 83.4,88.59 74.36,88.59 74,88.59 73.64,88.59
  Top 0.508: H193.B2,8 95,93.98
  Top 0.813: v83.73,89 83.75,88.61 83.77,87.55 | 83.77,87.55 83.77,85 | 83.77,85 83.76,81.05 U151.17 87.39,81.02 | U151.22 83.77,87.55 | v74,89 74,88.59 74,88.35 74,88.2 74,81.59 73.98,81.02 71.95,81.02 72.34,81.05 U151.6 70.83,81.02 v70.8,81.03 | U151.20 83.77,85 | C151.2 87.38,77.85 87.39,81.02 | v95.85,83.01 95.83,83.38 96,83.78 | v99.18,86.3 98.88,86 98.67,86 | v87.69,81.16 87.56,81.02 87.39,81.02 | v95.75,89.58 95.17,89 95,89 | 93.48,88.84 93.05,88.84 86.64,88.84 85.6,87.81 85.36,87.57
  Top 1.27: CON181.4 95,88.86 | 95,88.86 CON181.2 98.67,86 CON181.3 96,83.78 CON181.5 | 95,93.98 95,89 95,88.86 | CON186.2 CON186.3 96,12.7 | CON186.2 CON185.3 | CON185.3 CON185.2 | CON185.2 98.79,29 | 98.79,29 CON184.3 | CON184.3 CON184.2 | CON184.2 CON183.3 | CON183.3 CON183.2 | CON183.3 96,40.64 | 96,40.64 CON183.5 | CON184.2 96.2,36.83 CON184.4 | CON184.3 CON184.5 | CON185.2 CON185.4 | CON185.3 96,21.59 | 96,21.59 CON185.5 | CON186.2 CON186.4 | 96,12.7 CON186.5 | v96.11,38.7 96.11,40.53 96,40.64 | v97.88,29.29 98.5,29.29 98.79,29 | v96.24,19.68 96.24,21.35 96,21.59 | v96,12 96,12.7 | 96.14,38.66 96.14,36.87 96.16,36.85 | 98.79,45.83 94.2,45.83
  Route2 0.127: v53.5,50.5 50,50.5 | v62.5,42.5 62.5,39 | v65.5,46.5 69,46.5 | v56.5,54.5 56.5,58 | v64.5,49.5 69,49.5 | v61.5,51.5 62.5,52.5 62.5,58
  Route15 0.127: v54.5,47.5 50,47.5 | v55.5,43.5 55.5,39 | v62.5,45.5 64.5,43.5 69,43.5 | v60.5,50.5 60.5,58
  Bottom 0.127: v58.5,44.5 58.5,39 | v60.5,44.5 60.5,39 | v61.5,44.5 61.5,39 | v62.5,47.5 69,47.5
  pour Bottom: 1.5,99.5 100.5,99.5 100.5,0.5 1.5,0.5
GPS_2ND_RX
  Top 0.127: U0401.T15 66,39
GPS_2ND_TX
  Top 0.127: U0401.T14 65,39
GPS_3DFIX  (via drill 0.2)
  Top 0.127: U0401.N13 v64.5,43.5
  Route2 0.127: v64.5,43.5 69,43.5
GPS_ANT
  Top 0.406: CON181.1 96.13,86.27 U151.21 90.1,86.27 LP151.1
GPS_NMEA_RX  (3 unrouted)
  Top 0.127: U0401.R16 69,42
GPS_NMEA_TX  (2 unrouted)
  Top 0.127: U0401.R15 66.5,41.5 69,41.5
  Top 0.203: 72.32,83.82 U151.4
GPS_PPS  (via drill 0.2)  (2 unrouted)
  Top 0.127: U0401.N11 v61.5,43.5
  Top 0.203: 72.32,85.04 U151.3
  Route15 0.127: v61.5,43.5 61.5,39
GPS_PWR_3V3  (4 unrouted)
  Top 0.305: C151.1 87.4,75.75 85.45,75.75 U151.13
GPS_RESET  (2 unrouted)
  Top 0.127: U0401.P13 63.5,42.5 63.5,39
L1  (1 unrouted)
L2  (1 unrouted)
L3  (1 unrouted)
L4A  (1 unrouted)
L4B  (1 unrouted)
L5  (1 unrouted)
L6  (1 unrouted)
N$1  (1 unrouted)
N$2  (2 unrouted)
N$3  (1 unrouted)
N$4  (1 unrouted)
N$6  (1 unrouted)
N$9
  Top 0.813: U151.19 LP151.2
N$11  (1 unrouted)
N$12
  Top 1.27: 86.83,86.27 96.31,86.27
N$13
  Top 1.27: 96.25,19.68 96.25,17.78 96.29,17.73
N$14
  Top 1.27: 96.27,19.68 96.27,17.91 96.29,17.89
PMU_AC_DET  (1 unrouted)
PMU_GPIO1  (1 unrouted)
  Top 0.127: U0401.T10 61,39
PMU_GPIO2  (1 unrouted)
  Top 0.127: U0401.R5 55.5,41.5 55.5,39
PMU_GPIO3  (1 unrouted)
  Top 0.127: U0401.T5 56,39
PMU_IN_CC#  (1 unrouted)
  Top 0.127: U0401.T8 59,39
PMU_INT#  (2 unrouted)
  Top 0.127: U0401.T9 60,39
PMU_PB  (1 unrouted)
PMU_PFO#  (via drill 0.2)  (2 unrouted)
  Top 0.127: U0401.M6 v56.5,44.5
  Route15 0.127: v56.5,44.5 56.5,39
PMU_PGOOD  (via drill 0.2)  (2 unrouted)
  Top 0.127: U0401.P8 v58.5,42.5
  Route2 0.127: v58.5,42.5 58.5,39
PMU_PGOOD_BU  (1 unrouted)
  Top 0.127: U0401.R8 58.5,41.5 58.5,39
PMU_PWR_EN  (via drill 0.2)  (2 unrouted)
  Top 0.127: U0401.N9 v59.5,43.5
  Route15 0.127: v59.5,43.5 59.5,39
PMU_WAKEUP#  (via drill 0.2)  (2 unrouted)
  Top 0.127: U0401.P9 v59.5,42.5
  Route2 0.127: v59.5,42.5 59.5,39
PWR_1V0  (4 unrouted)
PWR_1V8  (3 unrouted)
PWR_1V25_PREC
  Top 0.127: U0401.J8 58.5,47.5
PWR_3V3  (via drill 0.2)  (37 unrouted)
  Top 0.127: U0401.M9 v59.5,44.5
  Bottom 0.127: v59.5,44.5 59.5,39
PWR_5V0  (21 unrouted)
PWR_BACKUP_3V3  (5 unrouted)
PWR_BAT_1V0  (2 unrouted)
PWR_BAT_1V8  (3 unrouted)
PWR_SW_3V3  (1 unrouted)
PWR_SW_5V0  (1 unrouted)
PWR_SW_VCCMEM  (1 unrouted)
PWR_VCCADC  (1 unrouted)
PWR_VCCMEM  (3 unrouted)
PWR_VCTCXO_3V0  (4 unrouted)
REFC_10MHZ_EN  (1 unrouted)
  Top 0.127: U0401.P15 66.5,42.5 69,42.5
REFC_10MHZ_N  (2 unrouted)
  Top 0.127: U0401.N16 69,44
REFC_10MHZ_P  (2 unrouted)
  Top 0.127: U0401.M16 69,45
REFC_20MHZ  (via drill 0.2)  (2 unrouted)
  Top 0.127: U0401.M15 66.5,44.5 69,44.5 | U0401.N12 v62.5,43.5
  Route15 0.127: v62.5,43.5 62.5,39
SCL  (3 unrouted)
  Top 0.127: U0401.R6 56.5,41.5 56.5,39
SDA  (3 unrouted)
  Top 0.127: U0401.R7 57.5,41.5 57.5,39
SYS_BU  (1 unrouted)
USB_D_MIN1  (3 unrouted)
USB_D_MNS  (via drill 0.2)  (1 unrouted)
  Top 0.127: U0401.M14 v65.5,44.5
  Route2 0.127: v65.5,44.5 69,44.5
USB_D_PLS  (via drill 0.2)  (1 unrouted)
  Top 0.127: U0401.L14 v65.5,45.5
  Route2 0.127: v65.5,45.5 69,45.5
USB_D_PLS1  (3 unrouted)
USB_DISC  (via drill 0.2)  (1 unrouted)
  Top 0.127: U0401.K13 v64.5,46.5
  Route15 0.127: v64.5,46.5 69,46.5
USB_PWR1  (1 unrouted)
VCTCXO_PWM  (via drill 0.2)  (1 unrouted)
  Top 0.127: U0401.P6 v56.5,42.5
  Route2 0.127: v56.5,42.5 56.5,39
VCTCXO_VC_IN  (4 unrouted)

## Text on the board
Top: Top
Route2: Route2
Route3: Route3
Route14: Route14
Route15: Route15
Bottom: Bot
tPlace: I2C | SERVICE-GPS | GPS-Ant. / MCX | 10 MHz / Ref-Out | USB-B | JTAG
bNames: DF4IAH / 10 MHz Ref.-Osc. / V 3.0